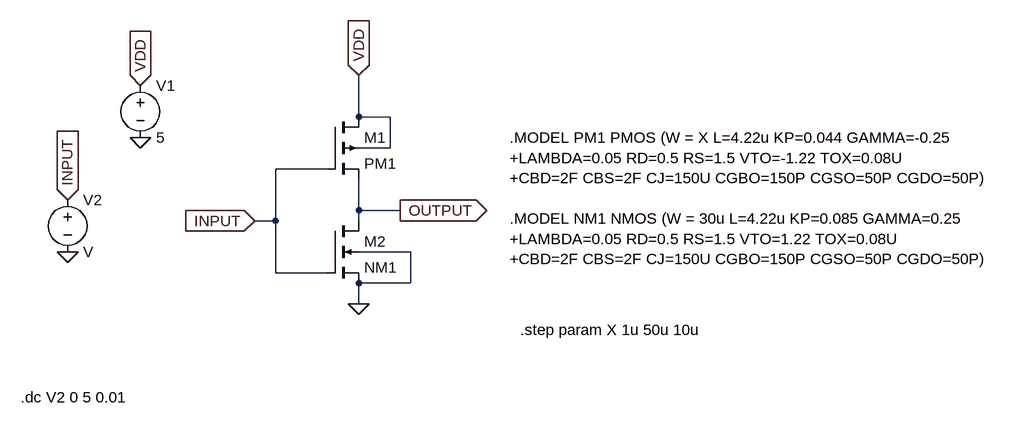
[diagram p0: schematic CMOS INVERTER_DC sweep Variable Width.asc]
CMOS INVERTER_DC sweep Variable Width.asc, the LTspice schematic file:
Version 4
SHEET 1 2408 680
WIRE 128 64 128 0
WIRE 176 64 128 64
WIRE 176 112 176 64
WIRE 176 112 128 112
WIRE 80 144 0 144
WIRE 128 208 128 160
WIRE 192 208 128 208
WIRE 0 224 0 144
WIRE 0 224 -32 224
WIRE 128 224 128 208
WIRE 208 272 128 272
WIRE 0 304 0 224
WIRE 80 304 0 304
WIRE 208 320 208 272
WIRE 208 320 128 320
WIRE 128 352 128 320
FLAG 128 352 0
FLAG -32 224 INPUT
IOPIN -32 224 In
FLAG 192 208 OUTPUT
IOPIN 192 208 Out
FLAG 128 0 VDD
IOPIN 128 0 In
FLAG -320 272 0
FLAG -208 96 0
FLAG -208 16 VDD
IOPIN -208 16 In
FLAG -320 192 INPUT
IOPIN -320 192 In
SYMBOL pmos4 80 64 R0
SYMATTR InstName M1
SYMATTR Value PM1
SYMBOL nmos4 80 224 R0
SYMATTR InstName M2
SYMATTR Value NM1
SYMBOL voltage -208 0 R0
WINDOW 123 0 0 Left 0
WINDOW 39 0 0 Left 0
SYMATTR InstName V1
SYMATTR Value 5
SYMBOL voltage -320 176 R0
SYMATTR InstName V2
TEXT -392 496 Left 2 !.dc V2 0 5 0.01
TEXT 360 96 Left 2 !.MODEL PM1 PMOS (W = X L=4.22u KP=0.044 GAMMA=-0.25\n+LAMBDA=0.05 RD=0.5 RS=1.5 VTO=-1.22 TOX=0.08U\n+CBD=2F CBS=2F CJ=150U CGBO=150P CGSO=50P CGDO=50P)\n \n.MODEL NM1 NMOS (W = 30u L=4.22u KP=0.085 GAMMA=0.25\n+LAMBDA=0.05 RD=0.5 RS=1.5 VTO=1.22 TOX=0.08U\n+CBD=2F CBS=2F CJ=150U CGBO=150P CGSO=50P CGDO=50P)
TEXT 376 392 Left 2 !.step param X 1u 50u 10u

The netlist it stands for:
* CMOS INVERTER_DC sweep Variable Width.asc
M1 VDD INPUT OUTPUT VDD PM1
M2 OUTPUT INPUT 0 0 NM1
V1 VDD 0 5
V2 INPUT 0 V
.model NMOS NMOS
.model PMOS PMOS
.lib standard.mos
.dc V2 0 5 0.01
.MODEL PM1 PMOS (W = X L=4.22u KP=0.044 GAMMA=-0.25
+LAMBDA=0.05 RD=0.5 RS=1.5 VTO=-1.22 TOX=0.08U
+CBD=2F CBS=2F CJ=150U CGBO=150P CGSO=50P CGDO=50P)
.MODEL NM1 NMOS (W = 30u L=4.22u KP=0.085 GAMMA=0.25
+LAMBDA=0.05 RD=0.5 RS=1.5 VTO=1.22 TOX=0.08U
+CBD=2F CBS=2F CJ=150U CGBO=150P CGSO=50P CGDO=50P)
.step param X 1u 50u 10u
.backanno
.end

* Results of the author's LTspice run, read from the files saved beside the schematic
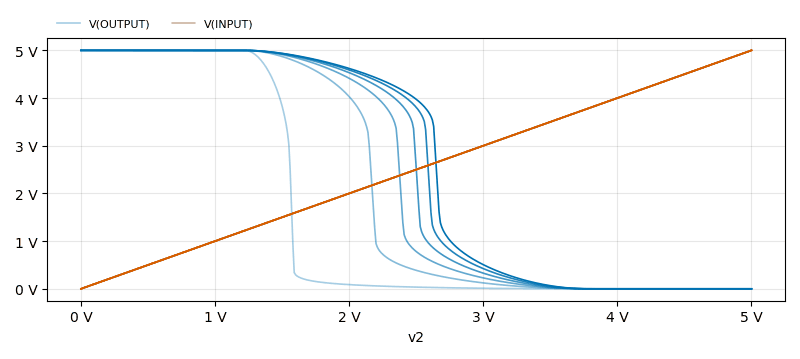
[diagram p1: DC transfer characteristic of CMOS INVERTER_DC sweep Variable Width.asc, plotted from the saved traces]
* DC transfer characteristic, 6 runs:
*   V(OUTPUT) [x=1e-06]: 5 V at v2=0 V, 24.4 pV at v2=5 V, min 24.4 pV, max 5 V
*   V(OUTPUT) [x=1.1e-05]: 5 V at v2=0 V, 24.4 pV at v2=5 V, min -2.754 pV, max 5 V
*   V(OUTPUT) [x=2.1e-05]: 5 V at v2=0 V, 24.4 pV at v2=5 V, min -79.91 pV, max 5 V
*   V(OUTPUT) [x=3.1e-05]: 5 V at v2=0 V, 24.4 pV at v2=5 V, min -205.1 pV, max 5 V
*   V(OUTPUT) [x=4.1e-05]: 5 V at v2=0 V, 24.4 pV at v2=5 V, min -378.1 pV, max 5 V
*   V(OUTPUT) [x=5e-05]: 5 V at v2=0 V, 24.4 pV at v2=5 V, min -574.6 pV, max 5 V
*   V(INPUT) [x=1e-06]: 0 V at v2=0 V, 5 V at v2=5 V, min 0 V, max 5 V
*   V(INPUT) [x=1.1e-05]: 0 V at v2=0 V, 5 V at v2=5 V, min 0 V, max 5 V
*   V(INPUT) [x=2.1e-05]: 0 V at v2=0 V, 5 V at v2=5 V, min 0 V, max 5 V
*   V(INPUT) [x=3.1e-05]: 0 V at v2=0 V, 5 V at v2=5 V, min 0 V, max 5 V
*   V(INPUT) [x=4.1e-05]: 0 V at v2=0 V, 5 V at v2=5 V, min 0 V, max 5 V
*   V(INPUT) [x=5e-05]: 0 V at v2=0 V, 5 V at v2=5 V, min 0 V, max 5 V